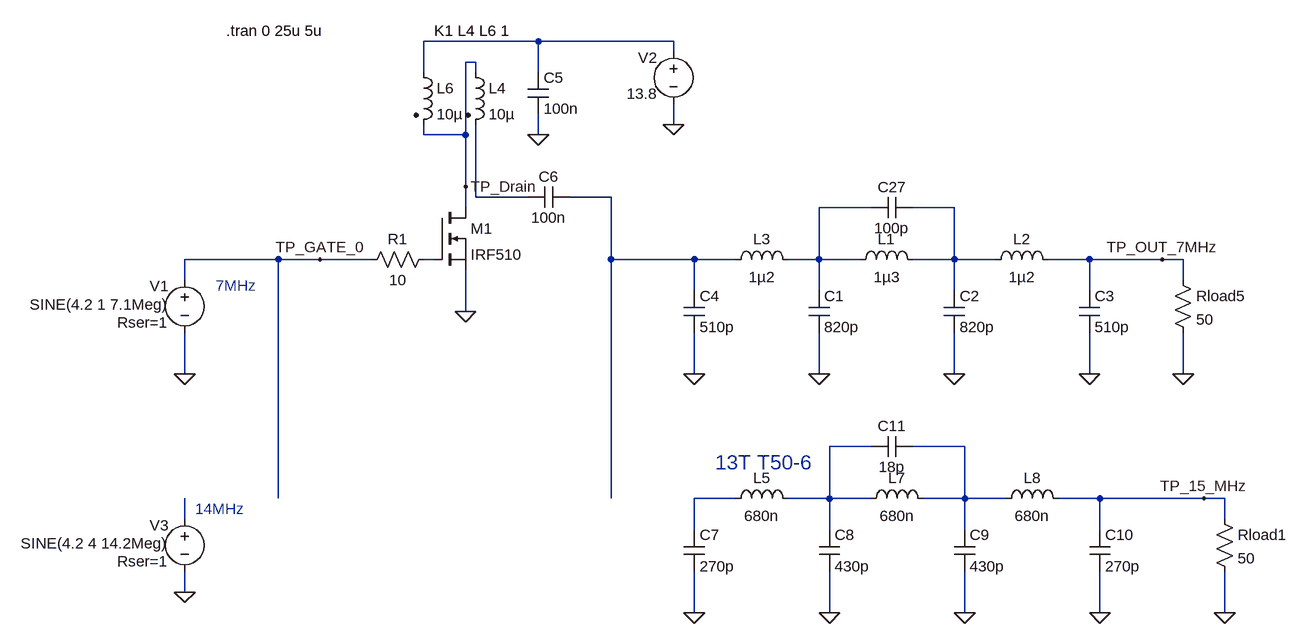
[diagram p0: schematic 4020 TX IRF510 7MHz 14MHz 7 Pole LPF Test 1.asc]
4020 TX IRF510 7MHz 14MHz 7 Pole LPF Test 1.asc, the LTspice schematic file:
Version 4
SHEET 1 2088 1892
WIRE 0 160 -176 160
WIRE 208 160 0 160
WIRE 208 176 208 160
WIRE -96 192 -112 192
WIRE -176 208 -176 160
WIRE -96 208 -96 192
WIRE 0 208 0 160
WIRE 208 288 208 256
WIRE -176 304 -176 288
WIRE -112 304 -112 192
WIRE -112 304 -176 304
WIRE 0 304 0 272
WIRE -112 384 -112 304
WIRE -96 400 -96 288
WIRE -16 400 -96 400
WIRE 112 400 48 400
WIRE -112 416 -112 384
WIRE 512 416 432 416
WIRE 640 416 576 416
WIRE -400 496 -544 496
WIRE -336 496 -400 496
WIRE -256 496 -336 496
WIRE -160 496 -176 496
WIRE 112 496 112 400
WIRE 240 496 112 496
WIRE 304 496 240 496
WIRE 432 496 432 416
WIRE 432 496 384 496
WIRE 496 496 432 496
WIRE 640 496 640 416
WIRE 640 496 576 496
WIRE 704 496 640 496
WIRE 848 496 784 496
WIRE 960 496 848 496
WIRE 992 496 960 496
WIRE -544 528 -544 496
WIRE 992 528 992 496
WIRE 240 544 240 496
WIRE 432 544 432 496
WIRE 640 544 640 496
WIRE 848 544 848 496
WIRE -112 576 -112 512
WIRE -544 672 -544 608
WIRE 240 672 240 608
WIRE 432 672 432 608
WIRE 640 672 640 608
WIRE 848 672 848 608
WIRE 992 672 992 608
WIRE 512 784 448 784
WIRE 656 784 576 784
WIRE -400 864 -400 496
WIRE 112 864 112 496
WIRE 304 864 240 864
WIRE 448 864 448 784
WIRE 448 864 384 864
WIRE 512 864 448 864
WIRE 656 864 656 784
WIRE 656 864 592 864
WIRE 720 864 656 864
WIRE 864 864 800 864
WIRE 1024 864 864 864
WIRE 1056 864 1024 864
WIRE -544 896 -544 864
WIRE 1056 896 1056 864
WIRE 240 912 240 864
WIRE 448 912 448 864
WIRE 656 912 656 864
WIRE 864 912 864 864
WIRE -544 1008 -544 976
WIRE 240 1040 240 976
WIRE 448 1040 448 976
WIRE 656 1040 656 976
WIRE 864 1040 864 976
WIRE 1056 1040 1056 976
FLAG -544 672 0
FLAG -112 576 0
FLAG -336 496 TP_GATE_0
FLAG 208 288 0
FLAG 0 304 0
FLAG 240 1040 0
FLAG 448 1040 0
FLAG 656 1040 0
FLAG 1056 1040 0
FLAG 1024 864 TP_15_MHz
FLAG 864 1040 0
FLAG -544 1008 0
FLAG -112 384 TP_Drain
FLAG 992 672 0
FLAG 960 496 TP_OUT_7MHz
FLAG 432 672 0
FLAG 640 672 0
FLAG 848 672 0
FLAG 240 672 0
SYMBOL nmos -160 416 R0
SYMATTR InstName M1
SYMATTR Value IRF510
SYMBOL cap 48 384 R90
WINDOW 0 0 32 VBottom 2
WINDOW 3 32 32 VTop 2
SYMATTR InstName C6
SYMATTR Value 100n
SYMBOL voltage -544 512 M0
WINDOW 123 25 89 Left 2
WINDOW 39 25 81 Left 2
WINDOW 0 25 25 Left 2
WINDOW 3 25 53 Left 2
SYMATTR SpiceLine Rser=1
SYMATTR InstName V1
SYMATTR Value SINE(4.2 1 7.1Meg)
SYMBOL voltage 208 160 M0
WINDOW 123 25 89 Left 2
WINDOW 39 25 53 Left 2
WINDOW 0 25 25 Left 2
WINDOW 3 25 81 Left 2
SYMATTR InstName V2
SYMATTR Value 13.8
SYMBOL ind2 -192 192 R0
SYMATTR InstName L6
SYMATTR Value 10µ
SYMATTR Type ind
SYMATTR SpiceLine Rser=14m
SYMBOL cap -16 208 R0
SYMATTR InstName C5
SYMATTR Value 100n
SYMBOL ind2 -112 192 R0
SYMATTR InstName L4
SYMATTR Value 10µ
SYMATTR Type ind
SYMATTR SpiceLine Rser=14m
SYMBOL cap 224 912 R0
SYMATTR InstName C7
SYMATTR Value 270p
SYMBOL cap 432 912 R0
SYMATTR InstName C8
SYMATTR Value 430p
SYMBOL ind 288 880 R270
WINDOW 0 32 56 VTop 2
WINDOW 3 5 56 VBottom 2
SYMATTR InstName L5
SYMATTR Value 680n
SYMBOL ind 496 880 R270
WINDOW 0 32 56 VTop 2
WINDOW 3 5 56 VBottom 2
SYMATTR InstName L7
SYMATTR Value 680n
SYMBOL cap 640 912 R0
SYMATTR InstName C9
SYMATTR Value 430p
SYMBOL res 1040 880 R0
SYMATTR InstName Rload1
SYMATTR Value 50
SYMBOL ind 704 880 R270
WINDOW 0 32 56 VTop 2
WINDOW 3 5 56 VBottom 2
SYMATTR InstName L8
SYMATTR Value 680n
SYMBOL cap 848 912 R0
SYMATTR InstName C10
SYMATTR Value 270p
SYMBOL cap 576 768 R90
WINDOW 0 0 32 VBottom 2
WINDOW 3 32 32 VTop 2
SYMATTR InstName C11
SYMATTR Value 18p
SYMBOL voltage -544 880 M0
WINDOW 123 25 89 Left 2
WINDOW 39 25 81 Left 2
WINDOW 0 25 25 Left 2
WINDOW 3 25 53 Left 2
SYMATTR SpiceLine Rser=1
SYMATTR InstName V3
SYMATTR Value SINE(4.2 4 14.2Meg)
SYMBOL res 976 512 R0
SYMATTR InstName Rload5
SYMATTR Value 50
SYMBOL cap 416 544 R0
SYMATTR InstName C1
SYMATTR Value 820p
SYMBOL cap 624 544 R0
SYMATTR InstName C2
SYMATTR Value 820p
SYMBOL ind 480 512 R270
WINDOW 0 32 56 VTop 2
WINDOW 3 5 56 VBottom 2
SYMATTR InstName L1
SYMATTR Value 1µ3
SYMATTR SpiceLine Rser=0.1
SYMBOL ind 688 512 R270
WINDOW 0 32 56 VTop 2
WINDOW 3 5 56 VBottom 2
SYMATTR InstName L2
SYMATTR Value 1µ2
SYMATTR SpiceLine Rser=0.1
SYMBOL cap 832 544 R0
SYMATTR InstName C3
SYMATTR Value 510p
SYMBOL cap 224 544 R0
SYMATTR InstName C4
SYMATTR Value 510p
SYMBOL ind 288 512 R270
WINDOW 0 32 56 VTop 2
WINDOW 3 5 56 VBottom 2
SYMATTR InstName L3
SYMATTR Value 1µ2
SYMATTR SpiceLine Rser=80m
SYMBOL cap 576 400 R90
WINDOW 0 0 32 VBottom 2
WINDOW 3 32 32 VTop 2
SYMATTR InstName C27
SYMATTR Value 100p
SYMBOL res -160 480 R90
WINDOW 0 0 56 VBottom 2
WINDOW 3 32 56 VTop 2
SYMATTR InstName R1
SYMATTR Value 10
TEXT -480 144 Left 2 !.tran 0 25u 5u
TEXT -160 144 Left 2 !K1 L4 L6 1
TEXT 272 808 Left 3 ;13T T50-6
TEXT -528 880 Left 2 ;14MHz
TEXT -496 536 Left 2 ;7MHz

The netlist it stands for:
* 4020 TX IRF510 7MHz 14MHz 7 Pole LPF Test 1.asc
M1 TP_Drain N006 0 0 IRF510
C6 N003 N002 100n
V1 TP_GATE_0 0 SINE(4.2 1 7.1Meg) Rser=1
V2 N001 0 13.8
L6 N001 TP_Drain 10µ Rser=14m
C5 N001 0 100n
L4 TP_Drain N002 10µ Rser=14m
C7 N009 0 270p
C8 N007 0 430p
L5 N009 N007 680n
L7 N007 N008 680n
C9 N008 0 430p
Rload1 TP_15_MHz 0 50
L8 N008 TP_15_MHz 680n
C10 TP_15_MHz 0 270p
C11 N008 N007 18p
V3 N010 0 SINE(4.2 4 14.2Meg) Rser=1
Rload5 TP_OUT_7MHz 0 50
C1 N004 0 820p
C2 N005 0 820p
L1 N004 N005 1µ3 Rser=0.1
L2 N005 TP_OUT_7MHz 1µ2 Rser=0.1
C3 TP_OUT_7MHz 0 510p
C4 N003 0 510p
L3 N003 N004 1µ2 Rser=80m
C27 N005 N004 100p
R1 N006 TP_GATE_0 10
.model NMOS NMOS
.model PMOS PMOS
.lib standard.mos
.tran 0 25u 5u
K1 L4 L6 1
* 13T T50-6
* 14MHz
* 7MHz
.backanno
.end